# Altium schematic sheet 00_COREBOARD.SchDoc
size A2; SheetNumber: 1; SheetTotal: 2
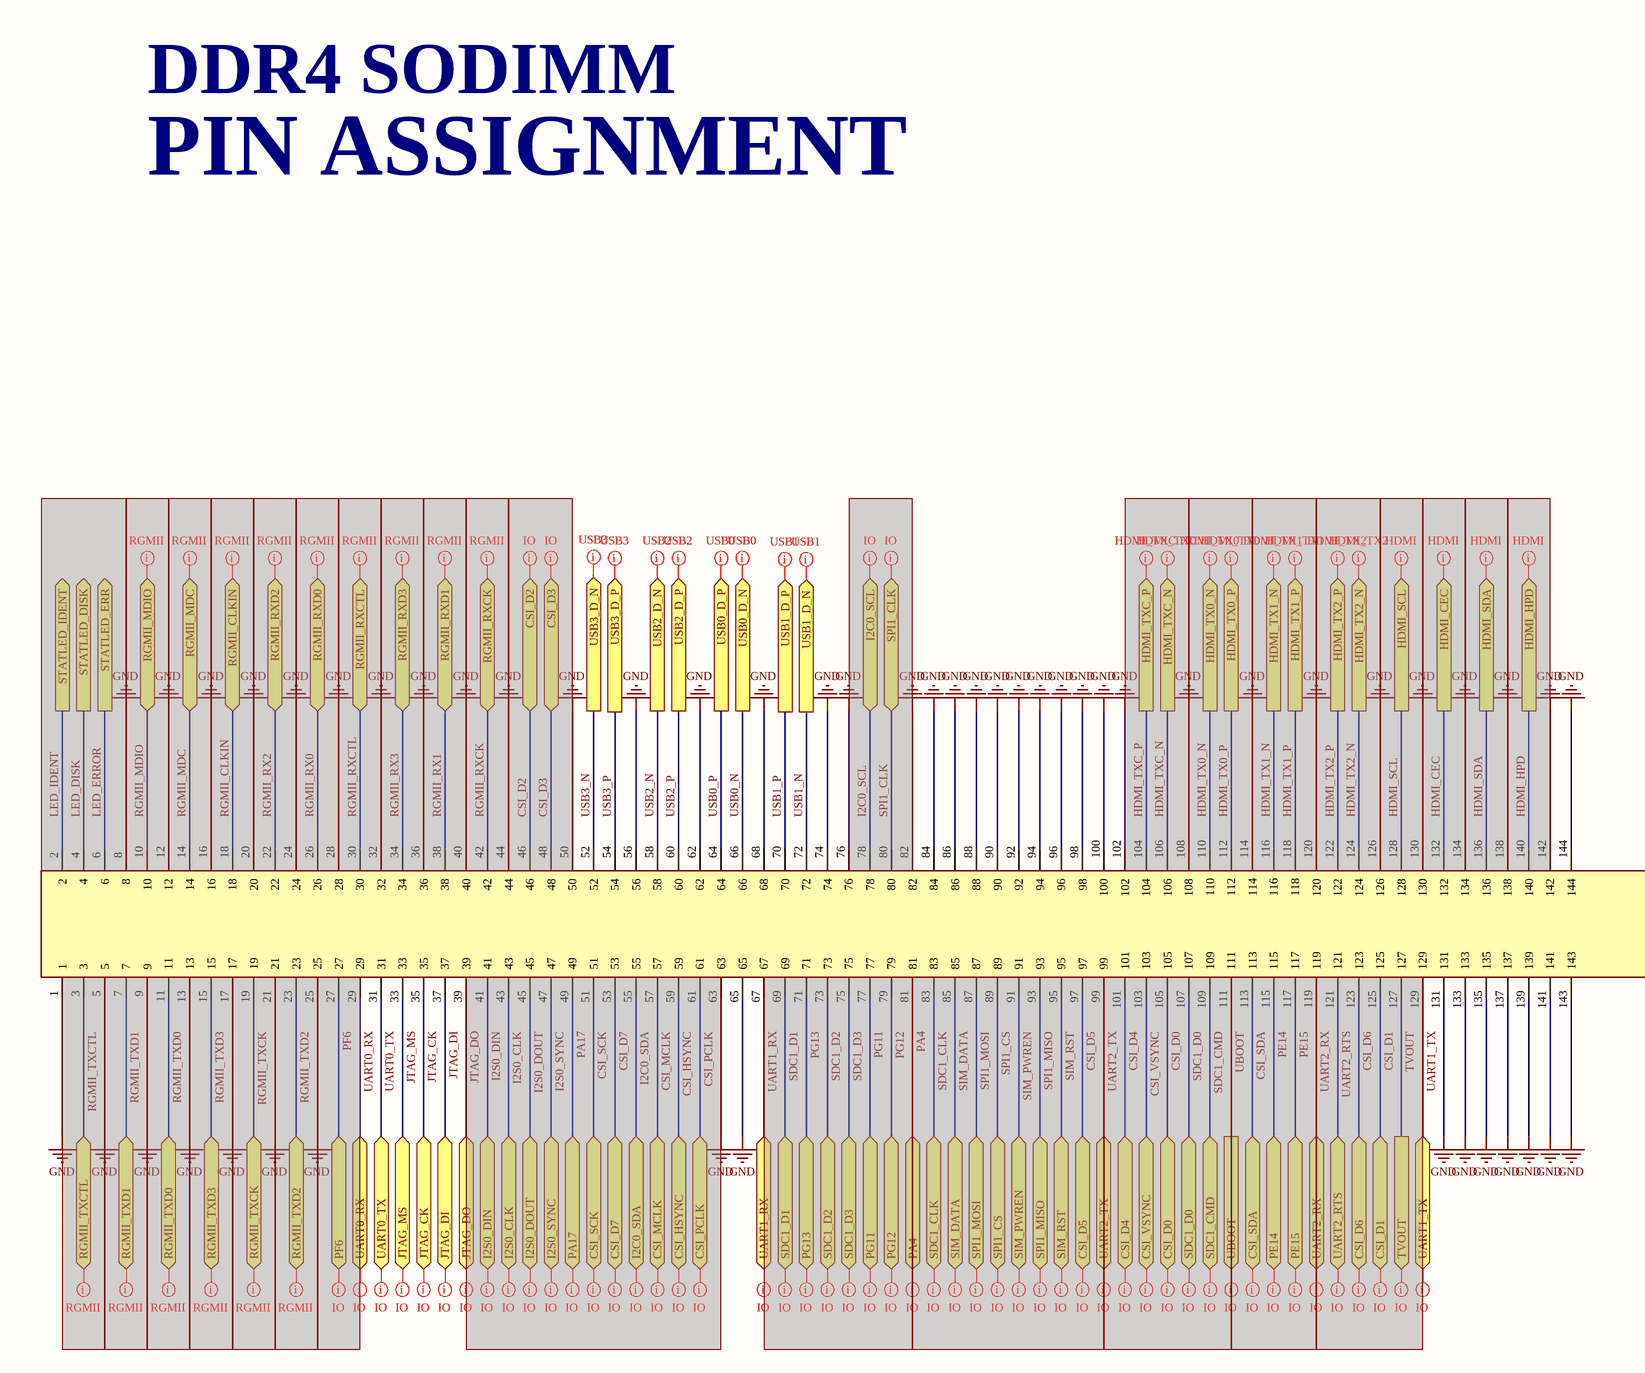
[diagram p0: 00_COREBOARD.SchDoc, left]
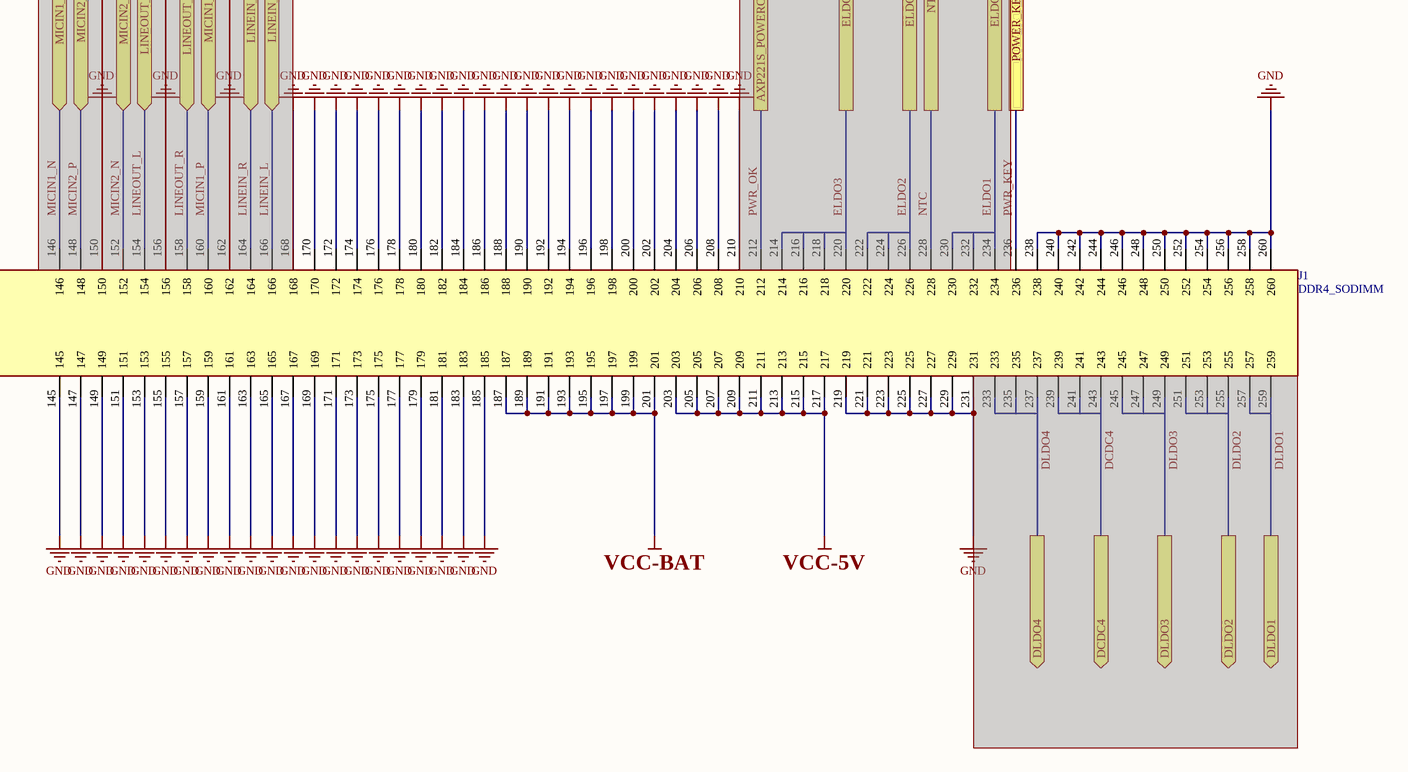
[diagram p1: 00_COREBOARD.SchDoc, right]

## Parts
J1  DDR4_SODIMM  [DDR4_SODIMM]

## Ports
AXP221S_POWEROK (out), CSI_D0 (bidir), CSI_D1 (bidir), CSI_D2 (bidir), CSI_D3 (bidir), CSI_D4 (bidir), CSI_D5 (bidir), CSI_D6 (bidir), CSI_D7 (bidir), CSI_HSYNC (bidir), CSI_MCLK (bidir), CSI_PCLK (bidir), CSI_SCK (bidir), CSI_SDA (bidir), CSI_VSYNC (bidir), DCDC4 (out), DLDO1 (out), DLDO2 (out), DLDO3 (out), DLDO4 (out), ELDO1 (out), ELDO2 (out), ELDO3 (out), HDMI_CEC (out), HDMI_HPD (out), HDMI_SCL (out), HDMI_SDA (out), HDMI_TX0_N (out), HDMI_TX0_P (out), HDMI_TX1_N (out), HDMI_TX1_P (out), HDMI_TX2_N (out), HDMI_TX2_P (out), HDMI_TXC_N (out), HDMI_TXC_P (out), I2C0_SCL (bidir), I2C0_SDA (bidir), I2S0_CLK (bidir), I2S0_DIN (bidir), I2S0_DOUT (bidir), I2S0_SYNC (bidir), JTAG_CK (bidir), JTAG_DI (bidir), JTAG_DO (bidir), JTAG_MS (bidir), LINEIN_L (bidir), LINEIN_R (bidir), LINEOUT_L (bidir), LINEOUT_R (bidir), MICIN1_N (bidir), MICIN1_P (bidir), MICIN2_N (bidir), MICIN2_P (bidir), NTC (out), PA4 (bidir), PA17 (bidir), PE14 (bidir), PE15 (bidir), PF6 (bidir), PG11 (bidir), PG12 (bidir), PG13 (bidir), POWER_KEY (out), RGMII_CLKIN (bidir), RGMII_MDC (bidir), RGMII_MDIO (bidir), RGMII_RXCK (bidir), RGMII_RXCTL (bidir), RGMII_RXD0 (bidir), RGMII_RXD1 (bidir), RGMII_RXD2 (bidir), RGMII_RXD3 (bidir), RGMII_TXCK (bidir), RGMII_TXCTL (bidir), RGMII_TXD0 (bidir), RGMII_TXD1 (bidir), RGMII_TXD2 (bidir), RGMII_TXD3 (bidir), SDC1_CLK (bidir), SDC1_CMD (bidir), SDC1_D0 (bidir), SDC1_D1 (bidir), SDC1_D2 (bidir), SDC1_D3 (bidir), SIM_DATA (bidir), SIM_PWREN (bidir), SIM_RST (bidir), SPI1_CLK (bidir), SPI1_CS (bidir), SPI1_MISO (bidir), SPI1_MOSI (bidir), STATLED_DISK (out), STATLED_ERR (out), STATLED_IDENT (out), TVOUT (out), UART0_RX (bidir), UART0_TX (bidir), UART1_RX (bidir), UART1_TX (bidir), UART2_RTS (bidir), UART2_RX (bidir), UART2_TX (bidir), UBOOT (out), USB0_D_N (out), USB0_D_P (out), USB1_D_N (out), USB1_D_P (out), USB2_D_N (out), USB2_D_P (out), USB3_D_N (out), USB3_D_P (out)

## Nets
GND: J1.56 J1.62 J1.65 J1.68 J1.74 J1.84 J1.86 J1.88 J1.90 J1.92 J1.94 J1.96 J1.98 J1.100 J1.131 J1.133 J1.135 J1.137 J1.139 J1.141 J1.143 J1.144 J1.145 J1.147 J1.149 J1.151 J1.153 J1.155 J1.157 J1.159 J1.161 J1.163 J1.165 J1.167 J1.169 J1.170 J1.171 J1.172 J1.173 J1.174 J1.175 J1.176 J1.177 J1.178 J1.179 J1.180 J1.181 J1.182 J1.183 J1.184 J1.185 J1.186 J1.188 J1.190 J1.192 J1.194 J1.196 J1.198 J1.200 J1.202 J1.204 J1.206 J1.208 J1.238 J1.240 J1.242 J1.244 J1.246 J1.248 J1.250 J1.252 J1.254 J1.256 J1.258 J1.260
VCC-5V: J1.203 J1.205 J1.207 J1.209 J1.211 J1.213 J1.215 J1.217
VCC-BAT: J1.187 J1.189 J1.191 J1.193 J1.195 J1.197 J1.199 J1.201
JTAG_CK: J1.35 ; port JTAG_CK
JTAG_DI: J1.37 ; port JTAG_DI
JTAG_MS: J1.33 ; port JTAG_MS
PWR_KEY: J1.236 ; port POWER_KEY
UART0_TX: J1.31 ; port UART0_TX
USB0_N: J1.66 ; port USB0_D_N
USB0_P: J1.64 ; port USB0_D_P
USB1_N: J1.72 ; port USB1_D_N
USB1_P: J1.70 ; port USB1_D_P
USB2_N: J1.58 ; port USB2_D_N
USB2_P: J1.60 ; port USB2_D_P
USB3_N: J1.52 ; port USB3_D_N
USB3_P: J1.54 ; port USB3_D_P
NetJ1_219: J1.219 J1.221 J1.223 J1.225 J1.227 J1.229

Not connected (* = marked no-connect by the designer): J1 1 2 3 4 5 6 7 8 9 10 11 12 13 14 15 16 17 18 19 20 21 22 23 24 25 26 27 28 29 30 32 34 36 38 39 40 41 42 43 44 45 46 47 48 49 50 51 53 55 57 59 61 63 67 69 71 73 75 76 77 78 79 80 81 82 83 85 87 89 91 93 95 97 99 101 102 103 104 105 106 107 108 109 110 111 112 113 114 115 116 117 118 119 120 121 122 123 124 125 126 127 128 129 130 132 134 136 138 140 142 146 148 150 152 154 156 158 160 162 164 166 168 210 212 214 216 218 220 222 224 226 228 230 231 232 233 234 235 237 239 241 243 245 247 249 251 253 255 257 259

## Layout directives
differential pair; differential pair class USB0; net class USB; rule Differential Pairs Routing [Pref Gap = 10mil    Min Gap  = 10mil    Max Gap  = 10milPref Width = 15mil    Min Width  = 15mil    Max Width  = 15mil]: USB0_N, USB0_P
differential pair; differential pair class USB2; net class USB; rule Differential Pairs Routing [Pref Gap = 10mil    Min Gap  = 10mil    Max Gap  = 10milPref Width = 15mil    Min Width  = 15mil    Max Width  = 15mil]: USB2_N, USB2_P
differential pair; differential pair class USB3; net class USB; rule Differential Pairs Routing [Pref Gap = 10mil    Min Gap  = 10mil    Max Gap  = 10milPref Width = 15mil    Min Width  = 15mil    Max Width  = 15mil]: USB3_N, USB3_P
differential pair; differential pair class USB1; net class USB; rule Differential Pairs Routing [Pref Gap = 10mil    Min Gap  = 10mil    Max Gap  = 10milPref Width = 15mil    Min Width  = 15mil    Max Width  = 15mil]: USB1_N, USB1_P
net class RGMII; rule Width Constraint [Pref Width = 4.99mil    Min Width = 4.99mil    Max Width = 4.99mil]: (no net found under the mark)
net class GPIO: (no net found under the mark), JTAG_CK, JTAG_DI, JTAG_MS, UART0_TX
differential pair; differential pair class HDMI_TX0; rule Differential Pairs Routing [Pref Gap = 6mil    Min Gap  = 6mil    Max Gap  = 6milPref Width = 4.29mil    Min Width  = 4.29mil    Max Width  = 4.29mil]; net class HDMI: (no net found under the mark)
differential pair; differential pair class HDMI_TX1; rule Differential Pairs Routing [Pref Gap = 6mil    Min Gap  = 6mil    Max Gap  = 6milPref Width = 4.29mil    Min Width  = 4.29mil    Max Width  = 4.29mil]; net class HDMI: (no net found under the mark)
differential pair; differential pair class HDMI_TX2; rule Differential Pairs Routing [Pref Gap = 6mil    Min Gap  = 6mil    Max Gap  = 6milPref Width = 4.29mil    Min Width  = 4.29mil    Max Width  = 4.29mil]; net class HDMI: (no net found under the mark)
differential pair; differential pair class HDMI_TXC; rule Differential Pairs Routing [Pref Gap = 6mil    Min Gap  = 6mil    Max Gap  = 6milPref Width = 4.29mil    Min Width  = 4.29mil    Max Width  = 4.29mil]; net class HDMI: (no net found under the mark)
net class GPIO; net class CSI: (no net found under the mark)
net class HDMI; rule Width Constraint [Pref Width = 4.99mil    Min Width = 4.99mil    Max Width = 4.99mil]: (no net found under the mark)

## Notes on the sheet
- DDR4 SODIMM
- PIN ASSIGNMENT